# Altium project Alarm_radiona.PrjPcb
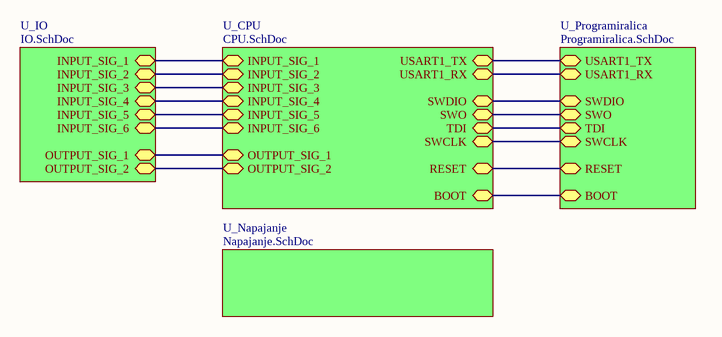
[diagram p0: Alarm_projekt.SchDoc]
5 sheets, 119 parts. Net scope: flat (ports and power ports of the same name join across sheets).
Board file: Alarm_V2.PcbDoc
Sheets:
  Alarm_projekt.SchDoc
    U_CPU = CPU.SchDoc
    U_IO = IO.SchDoc
    U_Napajanje = Napajanje.SchDoc
    U_Programiralica = Programiralica.SchDoc

## Sheet Alarm_projekt.SchDoc: CPU board
size A4; Date: 8.11.2020; DrawnBy: Borna Barisic; SheetNumber: 1; ProjectName: Alarm radiona

### Sub-sheets
U_CPU = CPU.SchDoc: INPUT_SIG_1 (bidir), INPUT_SIG_2 (bidir), INPUT_SIG_3 (bidir), INPUT_SIG_4 (bidir), INPUT_SIG_5 (bidir), INPUT_SIG_6 (bidir), OUTPUT_SIG_1 (bidir), OUTPUT_SIG_2 (bidir), USART1_TX (bidir), USART1_RX (bidir), BOOT (bidir), RESET (bidir), SWDIO (bidir), SWO (bidir), SWCLK (bidir), TDI (bidir)
U_IO = IO.SchDoc: INPUT_SIG_1 (bidir), INPUT_SIG_2 (bidir), INPUT_SIG_3 (bidir), INPUT_SIG_4 (bidir), INPUT_SIG_5 (bidir), INPUT_SIG_6 (bidir), OUTPUT_SIG_1 (bidir), OUTPUT_SIG_2 (bidir)
U_Napajanje = Napajanje.SchDoc: no entries
U_Programiralica = Programiralica.SchDoc: USART1_TX (bidir), USART1_RX (bidir), BOOT (bidir), RESET (bidir), TDI (bidir), SWDIO (bidir), SWO (bidir), SWCLK (bidir)

### Nets
(unnamed): sheet U_CPU/INPUT_SIG_1, sheet U_IO/INPUT_SIG_1
(unnamed): sheet U_CPU/INPUT_SIG_2, sheet U_IO/INPUT_SIG_2
(unnamed): sheet U_CPU/INPUT_SIG_3, sheet U_IO/INPUT_SIG_3
(unnamed): sheet U_CPU/INPUT_SIG_4, sheet U_IO/INPUT_SIG_4
(unnamed): sheet U_CPU/INPUT_SIG_5, sheet U_IO/INPUT_SIG_5
(unnamed): sheet U_CPU/INPUT_SIG_6, sheet U_IO/INPUT_SIG_6
(unnamed): sheet U_CPU/OUTPUT_SIG_1, sheet U_IO/OUTPUT_SIG_1
(unnamed): sheet U_CPU/OUTPUT_SIG_2, sheet U_IO/OUTPUT_SIG_2
(unnamed): sheet U_CPU/USART1_TX, sheet U_Programiralica/USART1_TX
(unnamed): sheet U_CPU/USART1_RX, sheet U_Programiralica/USART1_RX
(unnamed): sheet U_CPU/BOOT, sheet U_Programiralica/BOOT
(unnamed): sheet U_CPU/RESET, sheet U_Programiralica/RESET
(unnamed): sheet U_CPU/SWDIO, sheet U_Programiralica/SWDIO
(unnamed): sheet U_CPU/SWO, sheet U_Programiralica/SWO
(unnamed): sheet U_CPU/SWCLK, sheet U_Programiralica/SWCLK
(unnamed): sheet U_CPU/TDI, sheet U_Programiralica/TDI

## Sheet CPU.SchDoc
size A4
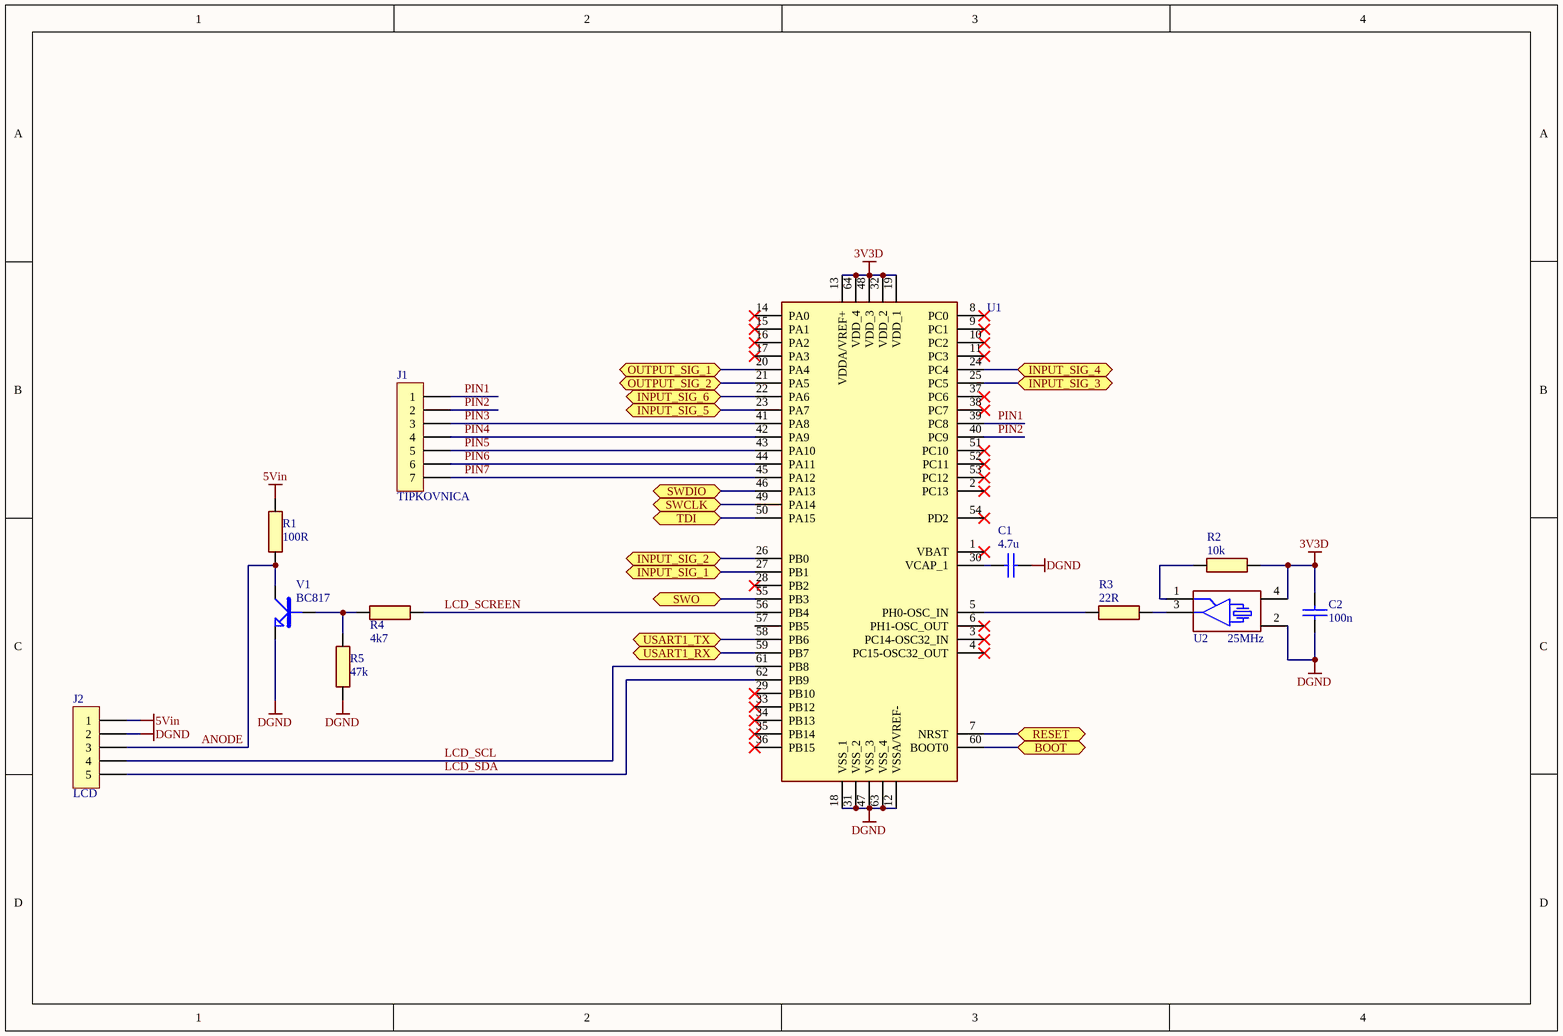
[diagram p1: CPU.SchDoc]

### Parts
C1  4.7u  [CAP_0805_SMD]
C2  100n  [CAP_0805_SMD]
J1  TIPKOVNICA  [CON-SIP-7]
J2  LCD  [CON-SIP-5]
R1  100R  [RES_0805_SMD]
R2  10k  [RES_0805_SMD]
R3  22R  [RES_0805_SMD]
R4  4k7  [RES_0805_SMD]
R5  47k  [RES_0805_SMD]
U1  STM32F446RE  [STM32F446RE]  (value not drawn)
U2  25MHz  [AQ-7050]
V1  BC817  [SOT-23_P]

### Ports
BOOT (bidir), INPUT_SIG_1 (bidir), INPUT_SIG_2 (bidir), INPUT_SIG_3 (bidir), INPUT_SIG_4 (bidir), INPUT_SIG_5 (bidir), INPUT_SIG_6 (bidir), OUTPUT_SIG_1 (bidir), OUTPUT_SIG_2 (bidir), RESET (bidir), SWCLK (bidir), SWDIO (bidir), SWO (bidir), TDI (bidir), USART1_RX (bidir), USART1_TX (bidir)

### Nets
3V3D: C2.2 R2.1 U1.13(VDDA/VREF+) U1.19(VDD_1) U1.32(VDD_2) U1.48(VDD_3) U1.64(VDD_4) U2.4(Vcc)
5Vin: J2.1 R1.2
DGND: C1.2 C2.1 J2.2 R5.1 U1.12(VSSA/VREF-) U1.18(VSS_1) U1.31(VSS_2) U1.47(VSS_3) U1.63(VSS_4) U2.2(DGND) V1.2(E)
ANODE: J2.3 R1.1 V1.3(C)
LCD_SCL: J2.4 U1.61(PB8)
LCD_SCREEN: R4.2 U1.56(PB4)
LCD_SDA: J2.5 U1.62(PB9)
PIN1: J1.1 U1.39(PC8)
PIN2: J1.2 U1.40(PC9)
PIN3: J1.3 U1.41(PA8)
PIN4: J1.4 U1.42(PA9)
PIN5: J1.5 U1.43(PA10)
PIN6: J1.6 U1.44(PA11)
PIN7: J1.7 U1.45(PA12)
NetC1_1: C1.1 U1.30(VCAP_1)
NetJ12_2: U1.60(BOOT0) ; port BOOT
NetJP1_2: U1.7(NRST) ; port RESET
NetR2_2: R2.2 U2.1(PV)
NetR3_1: R3.1 U2.3(Out)
NetR3_2: R3.2 U1.5(PH0-OSC_IN)
NetR4_1: R4.1 R5.2 V1.1(B)
NetR6_2: U1.20(PA4) ; port OUTPUT_SIG_1
NetR7_1: U1.21(PA5) ; port OUTPUT_SIG_2
NetR10_1: U1.27(PB1) ; port INPUT_SIG_1
NetR11_1: U1.26(PB0) ; port INPUT_SIG_2
NetR12_1: U1.25(PC5) ; port INPUT_SIG_3
NetR19_1: U1.24(PC4) ; port INPUT_SIG_4
NetR20_1: U1.23(PA7) ; port INPUT_SIG_5
NetR21_1: U1.22(PA6) ; port INPUT_SIG_6
NetR35_1: U1.46(PA13) ; port SWDIO
NetR36_1: U1.49(PA14) ; port SWCLK
NetR37_1: U1.55(PB3) ; port SWO
NetR38_1: U1.50(PA15) ; port TDI
NetU1_58: U1.58(PB6) ; port USART1_TX
NetU1_59: U1.59(PB7) ; port USART1_RX

Not connected (* = marked no-connect by the designer): U1 1(VBAT)* 2(PC13)* 3(PC14-OSC32_IN)* 4(PC15-OSC32_OUT)* 6(PH1-OSC_OUT)* 8(PC0)* 9(PC1)* 10(PC2)* 11(PC3)* 14(PA0)* 15(PA1)* 16(PA2)* 17(PA3)* 28(PB2)* 29(PB10)* 33(PB12)* 34(PB13)* 35(PB14)* 36(PB15)* 37(PC6)* 38(PC7)* 51(PC10)* 52(PC11)* 53(PC12)* 54(PD2)* 57(PB5)

### Library data of the parts
C1 C2 = CAP: 0805
J1 = CON7: 7 Pin connector
J2 = CON5: 5 Pin connector
R1-R5 = RES: 0805
U1 = STM32F446RE: STM microcontroller
U2 = OSCILATOR: Oscillator
V1 = BC817: NPN tranzistor BC-817

## Sheet IO.SchDoc
size A3
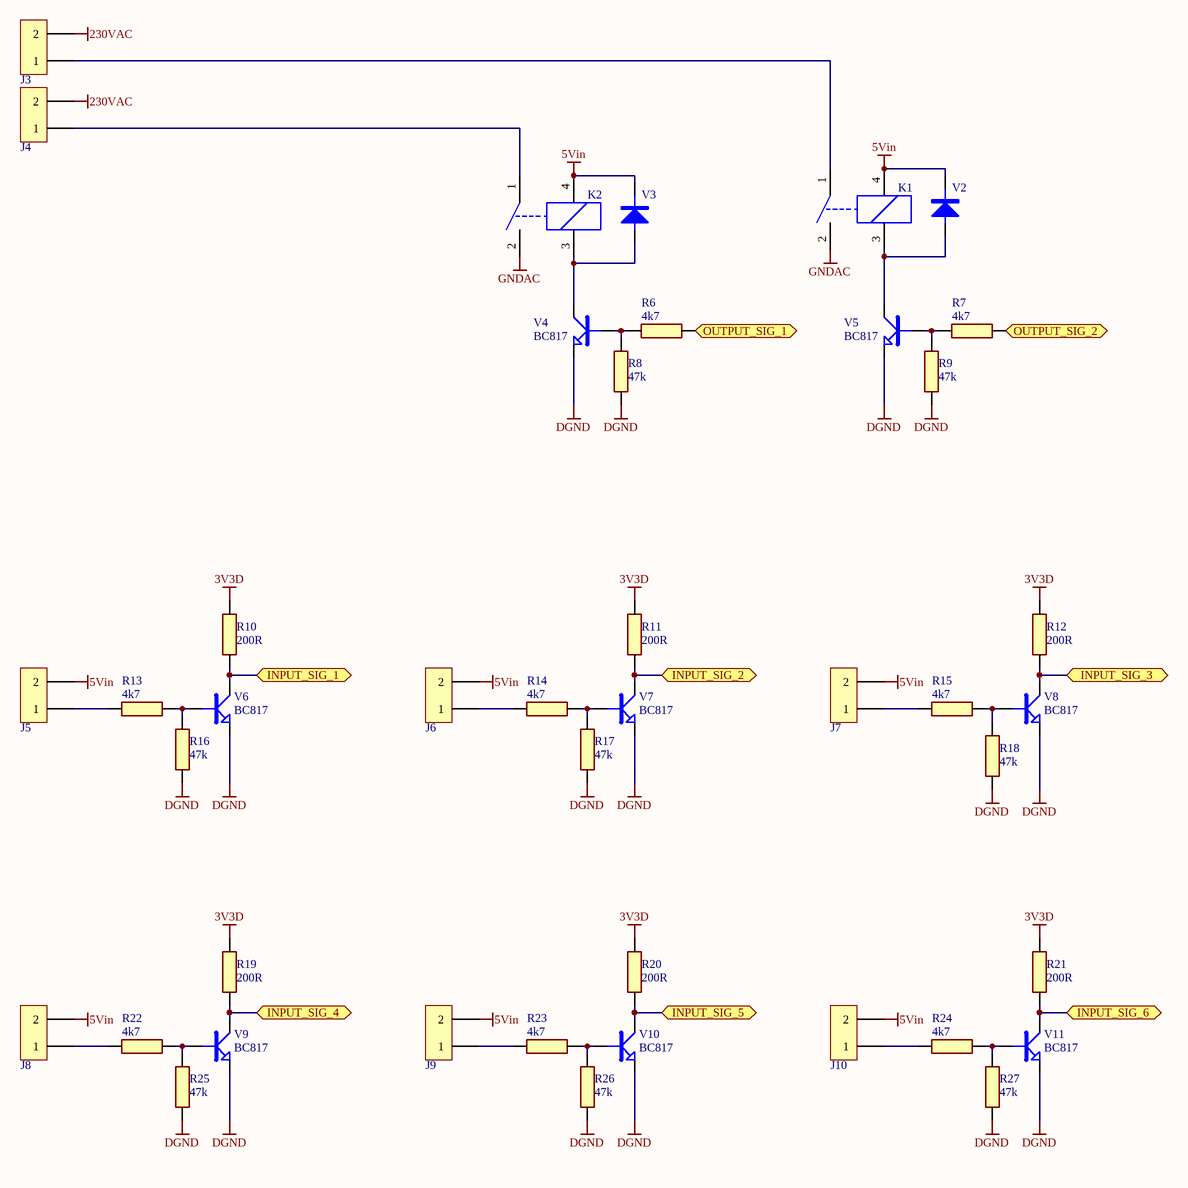
[diagram p2: IO.SchDoc]

### Parts
J3  CON2  [CON-MSTB-5.08-2p]  (value not drawn)
J4  CON2  [CON-MSTB-5.08-2p]  (value not drawn)
J5  CON2  [CON-MSTB-5.08-2p]  (value not drawn)
J6  CON2  [CON-MSTB-5.08-2p]  (value not drawn)
J7  CON2  [CON-MSTB-5.08-2p]  (value not drawn)
J8  CON2  [CON-MSTB-5.08-2p]  (value not drawn)
J9  CON2  [CON-MSTB-5.08-2p]  (value not drawn)
J10  CON2  [CON-MSTB-5.08-2p]  (value not drawn)
K1  RELAY-HF49FD_012-1H12F  [RELAY-HF49FD_012-1H12F]  (value not drawn)
K2  RELAY-HF49FD_012-1H12F  [RELAY-HF49FD_012-1H12F]  (value not drawn)
R6  4k7  [RES_0805_SMD]
R7  4k7  [RES_0805_SMD]
R8  47k  [RES_0805_SMD]
R9  47k  [RES_0805_SMD]
R10  200R  [RES_0805_SMD]
R11  200R  [RES_0805_SMD]
R12  200R  [RES_0805_SMD]
R13  4k7  [RES_0805_SMD]
R14  4k7  [RES_0805_SMD]
R15  4k7  [RES_0805_SMD]
R16  47k  [RES_0805_SMD]
R17  47k  [RES_0805_SMD]
R18  47k  [RES_0805_SMD]
R19  200R  [RES_0805_SMD]
R20  200R  [RES_0805_SMD]
R21  200R  [RES_0805_SMD]
R22  4k7  [RES_0805_SMD]
R23  4k7  [RES_0805_SMD]
R24  4k7  [RES_0805_SMD]
R25  47k  [RES_0805_SMD]
R26  47k  [RES_0805_SMD]
R27  47k  [RES_0805_SMD]
V2  DIODE  [DIODE-0.4_H]  (value not drawn)
V3  DIODE  [DIODE-0.4_H]  (value not drawn)
V4  BC817  [SOT-23_P]
V5  BC817  [SOT-23_P]
V6  BC817  [SOT-23_P]
V7  BC817  [SOT-23_P]
V8  BC817  [SOT-23_P]
V9  BC817  [SOT-23_P]
V10  BC817  [SOT-23_P]
V11  BC817  [SOT-23_P]

### Ports
INPUT_SIG_1 (bidir), INPUT_SIG_2 (bidir), INPUT_SIG_3 (bidir), INPUT_SIG_4 (bidir), INPUT_SIG_5 (bidir), INPUT_SIG_6 (bidir), OUTPUT_SIG_1 (bidir), OUTPUT_SIG_2 (bidir)

### Nets
3V3D: R10.2 R11.2 R12.2 R19.2 R20.2 R21.2
5Vin: J5.2 J6.2 J7.2 J8.2 J9.2 J10.2 K1.4(COIL_2) K2.4(COIL_2) V2.2 V3.2
230VAC: J3.2 J4.2
DGND: R8.1 R9.1 R16.1 R17.2 R18.1 R25.2 R26.1 R27.2 V4.2(E) V5.2(E) V6.2(E) V7.2(E) V8.2(E) V9.2(E) V10.2(E) V11.2(E)
GNDAC: K1.2(NO) K2.2(NO)
NetJ3_1: J3.1 K1.1(COM)
NetJ4_1: J4.1 K2.1(COM)
NetJ5_1: J5.1 R13.1
NetJ6_1: J6.1 R14.1
NetJ7_1: J7.1 R15.1
NetJ8_1: J8.1 R22.2
NetJ9_1: J9.1 R23.1
NetJ10_1: J10.1 R24.2
NetK1_3: K1.3(COIL_1) V2.1 V5.3(C)
NetK2_3: K2.3(COIL_1) V3.1 V4.3(C)
NetR6_1: R6.1 R8.2 V4.1(B)
NetR6_2: R6.2 ; port OUTPUT_SIG_1
NetR7_1: R7.1 ; port OUTPUT_SIG_2
NetR7_2: R7.2 R9.2 V5.1(B)
NetR10_1: R10.1 V6.3(C) ; port INPUT_SIG_1
NetR11_1: R11.1 V7.3(C) ; port INPUT_SIG_2
NetR12_1: R12.1 V8.3(C) ; port INPUT_SIG_3
NetR13_2: R13.2 R16.2 V6.1(B)
NetR14_2: R14.2 R17.1 V7.1(B)
NetR15_2: R15.2 R18.2 V8.1(B)
NetR19_1: R19.1 V9.3(C) ; port INPUT_SIG_4
NetR20_1: R20.1 V10.3(C) ; port INPUT_SIG_5
NetR21_1: R21.1 V11.3(C) ; port INPUT_SIG_6
NetR22_1: R22.1 R25.1 V9.1(B)
NetR23_2: R23.2 R26.2 V10.1(B)
NetR24_1: R24.1 R27.1 V11.1(B)

### Library data of the parts
J3-J10 = CON2: 2 pole connector
K1 K2 = RELAY-HF49FD_012-1H12F: Relay
R6-R27 = RES: 0805
V2 V3 = DIODE: Trough hole diode
V4-V11 = BC817: NPN tranzistor BC-817

## Sheet Napajanje.SchDoc
size A4
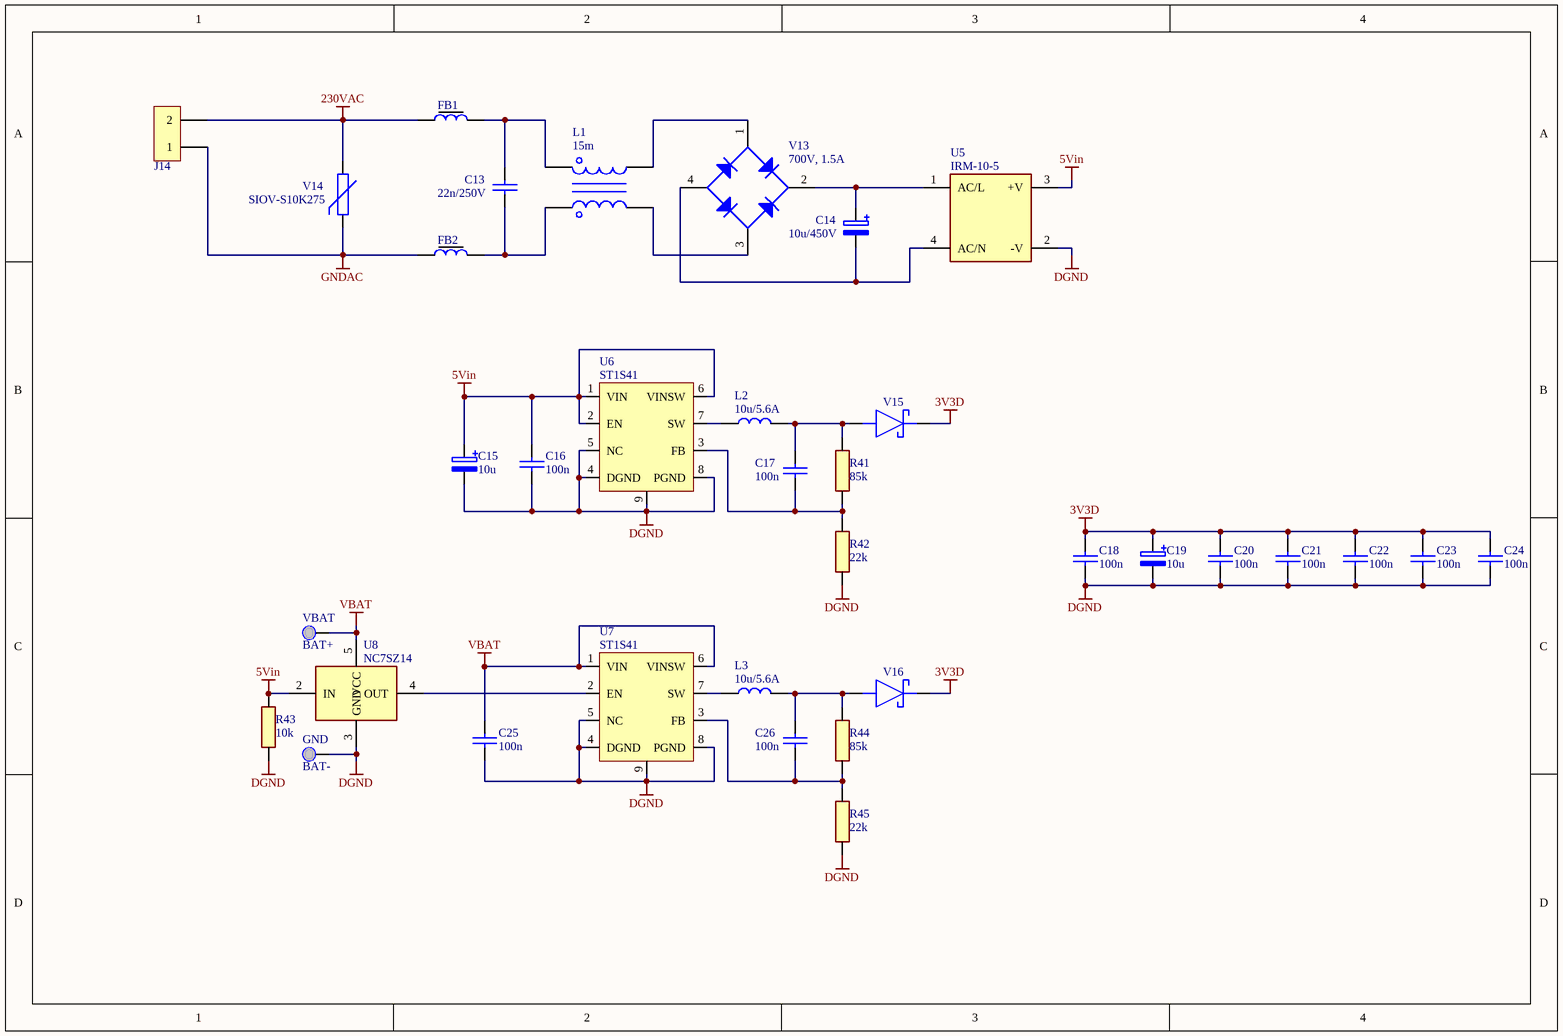
[diagram p3: Napajanje.SchDoc]

### Parts
BAT+  VBAT  [PAD_th]
BAT-  GND  [PAD_th]
C13  22n/250V  [CAP_CK03_TH]
C14  10u/450V  [CAP_EL_ALU]
C15  10u  [CAP_EL_CASE_B_SMD]
C16  100n  [CAP_0805_SMD]
C17  100n  [CAP_0805_SMD]
C18  100n  [CAP_0805_SMD]
C19  10u  [CAP_EL_CASE_B_SMD]
C20  100n  [CAP_0805_SMD]
C21  100n  [CAP_0805_SMD]
C22  100n  [CAP_0805_SMD]
C23  100n  [CAP_0805_SMD]
C24  100n  [CAP_0805_SMD]
C25  100n  [CAP_0805_SMD]
C26  100n  [CAP_0805_SMD]
FB1  (no value)  [FERITE_BEAD]
FB2  (no value)  [FERITE_BEAD]
J14  CON2  [CON-MSTB-5.08-2p]  (value not drawn)
L1  15m  [CHOKE_10_12.5]
L2  10u/5.6A  [PIS4720]
L3  10u/5.6A  [PIS4720]
R41  85k  [RES_0805_SMD]
R42  22k  [RES_0805_SMD]
R43  10k  [RES_0805_SMD]
R44  85k  [RES_0805_SMD]
R45  22k  [RES_0805_SMD]
U5  IRM-10-5  [IRM-10-5]
U6  ST1S41  [ST1S41]
U7  ST1S41  [ST1S41]
U8  NC7SZ14  [NC7SZ14]
V13  700V, 1.5A  [GRETZ]
V14  SIOV-S10K275  [VARISTOR]
V15  DIODE SCHOTTKY  [DIODE-SCHOTTKY]  (value not drawn)
V16  DIODE SCHOTTKY  [DIODE-SCHOTTKY]  (value not drawn)

### Nets
3V3D: C18.2 C19.1 C20.2 C21.2 C22.2 C23.2 C24.2 V15.1(K) V16.1(K)
5Vin: C15.1 C16.2 R43.2 U5.3(+V) U6.1(VIN) U6.2(EN) U6.6(VINSW) U8.2(IN)
230VAC: FB1.1 J14.2 V14.2
DGND: BAT-.1 C15.2 C16.1 C18.1 C19.2 C20.1 C21.1 C22.1 C23.1 C24.1 C25.1 R42.1 R43.1 R45.1 U5.2(-V) U6.4(DGND) U6.5(NC) U6.8(PGND) U6.9(DGND) U7.4(DGND) U7.5(NC) U7.8(PGND) U7.9(DGND) U8.3(GND)
GNDAC: FB2.1 J14.1 V14.1
VBAT: BAT+.1 C25.2 U7.1(VIN) U7.6(VINSW) U8.5(VCC)
NetC13_1: C13.1 FB2.2 L1.1
NetC13_2: C13.2 FB1.2 L1.2
NetC14_1: C14.1 U5.1(AC/L) V13.2
NetC14_2: C14.2 U5.4(AC/N) V13.4
NetC17_1: C17.1 R41.1 R42.2 U6.3(FB)
NetC17_2: C17.2 L2.2 R41.2 V15.2(A)
NetC26_1: C26.1 R44.1 R45.2 U7.3(FB)
NetC26_2: C26.2 L3.2 R44.2 V16.2(A)
NetL1_3: L1.3 V13.3
NetL1_4: L1.4 V13.1
NetL2_1: L2.1 U6.7(SW)
NetL3_1: L3.1 U7.7(SW)
NetU7_2: U7.2(EN) U8.4(OUT)

### Library data of the parts
BAT+ BAT- = PAD: Single pad
C13 = CAP_CK03: MKX2AW24702F00KSSD; Manufacturer_Name: WIMA; Datasheet Link: https://componentsearchengine.com//MKX2AW24702F00KSSD.pdf; Height: 12.5mm; Mouser2 Part Number: 505-MKX2AW24702F00KS; Mouser2 Price/Stock: https://www.mouser.com/Search/Refine.aspx?Keyword=505-MKX2AW24702F00KS; Manufacturer_Part_Number: MKX2AW24702F00KSSD
C14 C15 C19 = CAP_EL: ELECTROLYTIC TH, CASE B
C16-C18 C20-C26 = CAP: 0805
FB1 FB2 = FERITE_BEAD: 875-HI1206N101R
J14 = CON2: 2 pole connector
L1 = CHOKE: 871-B82731M290
L2 L3 = INDUCTOR
R41-R45 = RES: 0805
U5 = IRM-10-5: AC-DC converter
U6 U7 = ST1S41: DC-DC Buck convertor
U8 = NC7SZ14: Invertor
V13 = GRETZ: W10G
V14 = VARISTOR
V15 V16 = DIODE SCHOTTKY: Schottky diode

## Sheet Programiralica.SchDoc
size A4
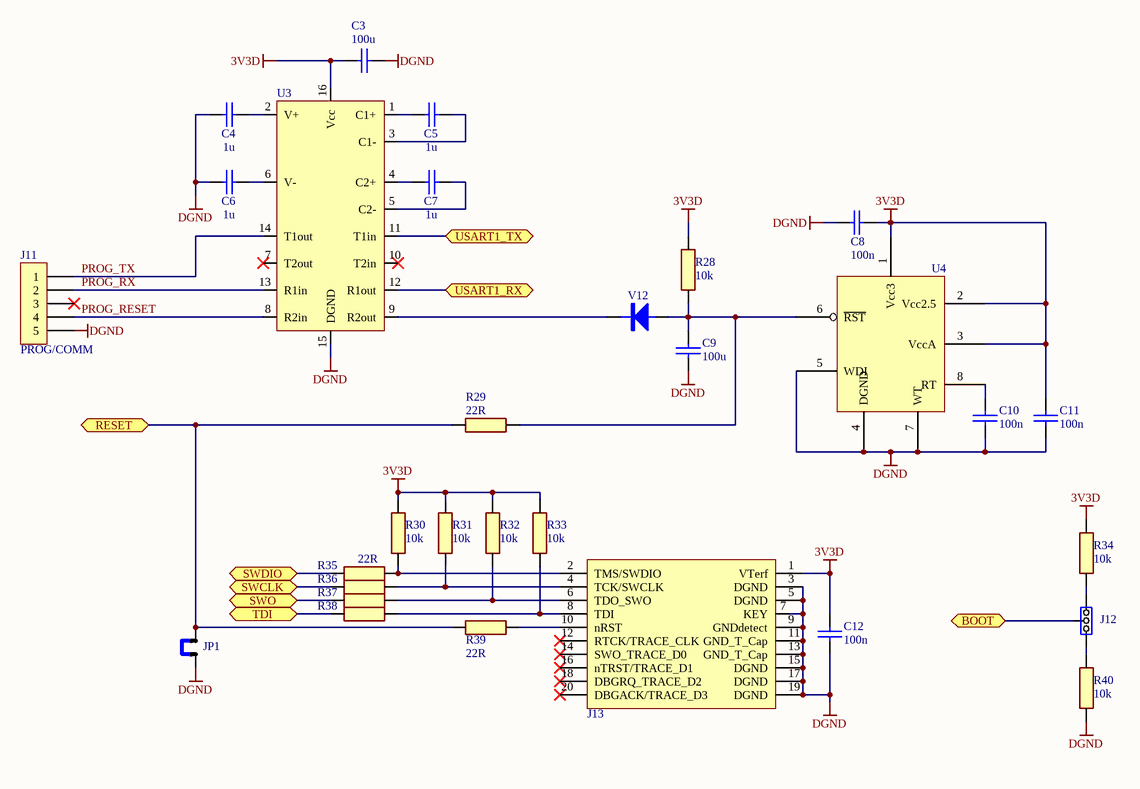
[diagram p4: Programiralica.SchDoc]

### Parts
C3  100u  [CAP_0805_SMD]
C4  1u  [CAP_0805_SMD]
C5  1u  [CAP_0805_SMD]
C6  1u  [CAP_0805_SMD]
C7  1u  [CAP_0805_SMD]
C8  100n  [CAP_0805_SMD]
C9  100u  [CAP_0805_SMD]
C10  100n  [CAP_0805_SMD]
C11  100n  [CAP_0805_SMD]
C12  100n  [CAP_0805_SMD]
J11  PROG/COMM  [CON-SIP-5]
J12  JUMPER_3_POLE  [JUMPER_3_POLE]  (value not drawn)
J13  JTAG-DEBUG-10x2  [JTAG-DEBUG-10x2-MOJ]  (value not drawn)
JP1  JUMPER  [KRATKO-LEMNI]  (value not drawn)
R28  10k  [RES_0805_SMD]
R29  22R  [RES_0805_SMD]
R30  10k  [RES_0805_SMD]
R31  10k  [RES_0805_SMD]
R32  10k  [RES_0805_SMD]
R33  10k  [RES_0805_SMD]
R34  10k  [RES_0805_SMD]
R35  22R  [RES_0805_SMD]
R36  22R  [RES_0805_SMD]  (value not drawn)
R37  22R  [RES_0805_SMD]  (value not drawn)
R38  22R  [RES_0805_SMD]  (value not drawn)
R39  22R  [RES_0805_SMD]
R40  10k  [RES_0805_SMD]
U3  MAX3232  [MAX3232]  (value not drawn)
U4  LTC1726  [LTC1726]  (value not drawn)
V12  DIODE  [SOD-323F]  (value not drawn)

### Ports
BOOT (bidir), RESET (bidir), SWCLK (bidir), SWDIO (bidir), SWO (bidir), TDI (bidir), USART1_RX (bidir), USART1_TX (bidir)

### Nets
3V3D: C3.1 C8.1 C11.2 C12.2 J13.1(VTerf) R28.2 R30.2 R31.2 R32.2 R33.2 R34.2 U3.16(Vcc) U4.1(Vcc3) U4.2(Vcc2.5) U4.3(VccA)
DGND: C3.2 C4.1 C6.1 C8.2 C9.1 C10.1 C11.1 C12.1 J11.5 J13.3(DGND) J13.5(DGND) J13.7(KEY) J13.9(GNDdetect) J13.11(GND_T_Cap) J13.13(GND_T_Cap) J13.15(DGND) J13.17(DGND) J13.19(DGND) JP1.1 R40.1 U3.15(DGND) U4.4(DGND) U4.5(WDI) U4.7(WT)
PROG_RESET: J11.4 U3.8(R2in)
PROG_RX: J11.2 U3.13(R1in)
PROG_TX: J11.1 U3.14(T1out)
NetC4_2: C4.2 U3.2(V+)
NetC5_1: C5.1 U3.1(C1+)
NetC5_2: C5.2 U3.3(C1-)
NetC6_2: C6.2 U3.6(V-)
NetC7_1: C7.1 U3.4(C2+)
NetC7_2: C7.2 U3.5(C2-)
NetC9_2: C9.2 R28.1 R29.2 U4.6(~{RST}) V12.1
NetC10_2: C10.2 U4.8(RT)
NetJ12_1: J12.1 R40.2
NetJ12_2: J12.2 ; port BOOT
NetJ12_3: J12.3 R34.1
NetJ13_2: J13.2(TMS/SWDIO) R30.1 R35.2
NetJ13_4: J13.4(TCK/SWCLK) R31.1 R36.2
NetJ13_6: J13.6(TDO_SWO) R32.1 R37.2
NetJ13_8: J13.8(TDI) R33.1 R38.2
NetJ13_10: J13.10(nRST) R39.2
NetJP1_2: JP1.2 R29.1 R39.1 ; port RESET
NetR35_1: R35.1 ; port SWDIO
NetR36_1: R36.1 ; port SWCLK
NetR37_1: R37.1 ; port SWO
NetR38_1: R38.1 ; port TDI
NetU1_58: U3.11(T1in) ; port USART1_TX
NetU1_59: U3.12(R1out) ; port USART1_RX
NetU3_9: U3.9(R2out) V12.2

Not connected (* = marked no-connect by the designer): J11 3*; J13 12(RTCK/TRACE_CLK)* 14(SWO_TRACE_D0)* 16(nTRST/TRACE_D1)* 18(DBGRQ_TRACE_D2)* 20(DBGACK/TRACE_D3)*; U3 7(T2out)* 10(T2in)*

### Library data of the parts
C3-C12 = CAP: 0805
J11 = CON5: 5 Pin connector
J12 = JUMPER_3_POLE: 3 Pole jumper
J13 = CON-JTAG-10x2
R28-R40 = RES: 0805
U3 = MAX3232: RS232 chip
V12 = DIODE: SMD diode

## Nets that join several sheets
3V3D: CPU (8 pins), IO (6 pins), Napajanje (9 pins), Programiralica (15 pins)
5Vin: CPU (J2.1 R1.2), IO (10 pins), Napajanje (8 pins)
230VAC: IO (J3.2 J4.2), Napajanje (FB1.1 J14.2 V14.2)
DGND: CPU (11 pins), IO (16 pins), Napajanje (24 pins), Programiralica (24 pins)
GNDAC: IO (K1.2 K2.2), Napajanje (FB2.1 J14.1 V14.1)
NetJ12_2: CPU (U1.60), Programiralica (J12.2)
NetJP1_2: CPU (U1.7), Programiralica (JP1.2 R29.1 R39.1)
NetR6_2: CPU (U1.20), IO (R6.2)
NetR7_1: CPU (U1.21), IO (R7.1)
NetR10_1: CPU (U1.27), IO (R10.1 V6.3)
NetR11_1: CPU (U1.26), IO (R11.1 V7.3)
NetR12_1: CPU (U1.25), IO (R12.1 V8.3)
NetR19_1: CPU (U1.24), IO (R19.1 V9.3)
NetR20_1: CPU (U1.23), IO (R20.1 V10.3)
NetR21_1: CPU (U1.22), IO (R21.1 V11.3)
NetR35_1: CPU (U1.46), Programiralica (R35.1)
NetR36_1: CPU (U1.49), Programiralica (R36.1)
NetR37_1: CPU (U1.55), Programiralica (R37.1)
NetR38_1: CPU (U1.50), Programiralica (R38.1)
NetU1_58: CPU (U1.58), Programiralica (U3.11)
NetU1_59: CPU (U1.59), Programiralica (U3.12)